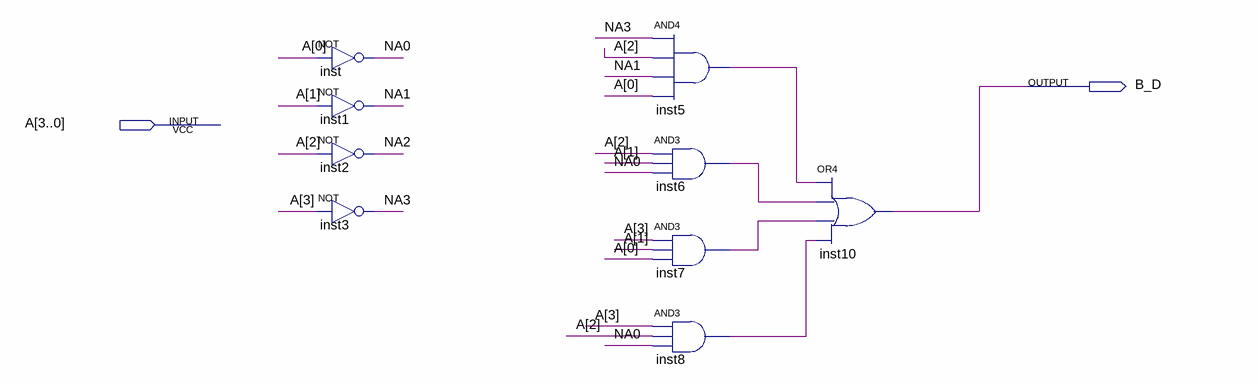
[diagram p0: schematic sheet]
// Quartus schematic Display_B.bdf as structural Verilog: 9 symbols, 2 pins
module Display_B (
  input  [3:0] A,
  output B_D
);

  wire inst5_out, inst6_out, inst7_out, inst8_out, NA0, NA1, NA2, NA3;

  not inst (NA0, A[0]);
  not inst1 (NA1, A[1]);
  not inst2 (NA2, A[2]);
  not inst3 (NA3, A[3]);
  and inst5 (inst5_out, NA3, A[2], NA1, A[0]);
  and inst6 (inst6_out, A[2], A[1], NA0);
  and inst7 (inst7_out, A[3], A[1], A[0]);
  and inst8 (inst8_out, A[3], A[2], NA0);
  or inst10 (B_D, inst5_out, inst6_out, inst7_out, inst8_out);
endmodule
